# EAGLE design untitled (EAGLE 8.3.1)
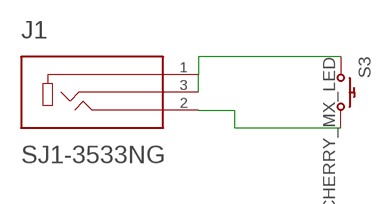
[diagram p0: schematic, sheet 1]

## Parts
J1  SJ1-3533NG  [CUI_SJ1-3533NG]
S3  CHERRY_MX_LED  [CHERRY_MX_LED]

## Nets
N$1: J1.1 J1.3 S3.S1
N$2: J1.2 S3.S2
Unconnected: S3.L1(A) S3.L2(C)

## Library data of the parts
J1 = SJ1-3533NG:SJ1-3533NG: 3.5 mm Right-Angle Stereo Jack, 3 Pin PCB Mount, Isolated Ground; MANUFACTURER: CUI; PARTREV: 1.02; STANDARD: Manufacturer recommendation
S3 = cherry:CHERRY_MX_LED: Cherry MX with LED; FARNELL: 2292961; MOUSER: 540_MX1A_11NW

## Board
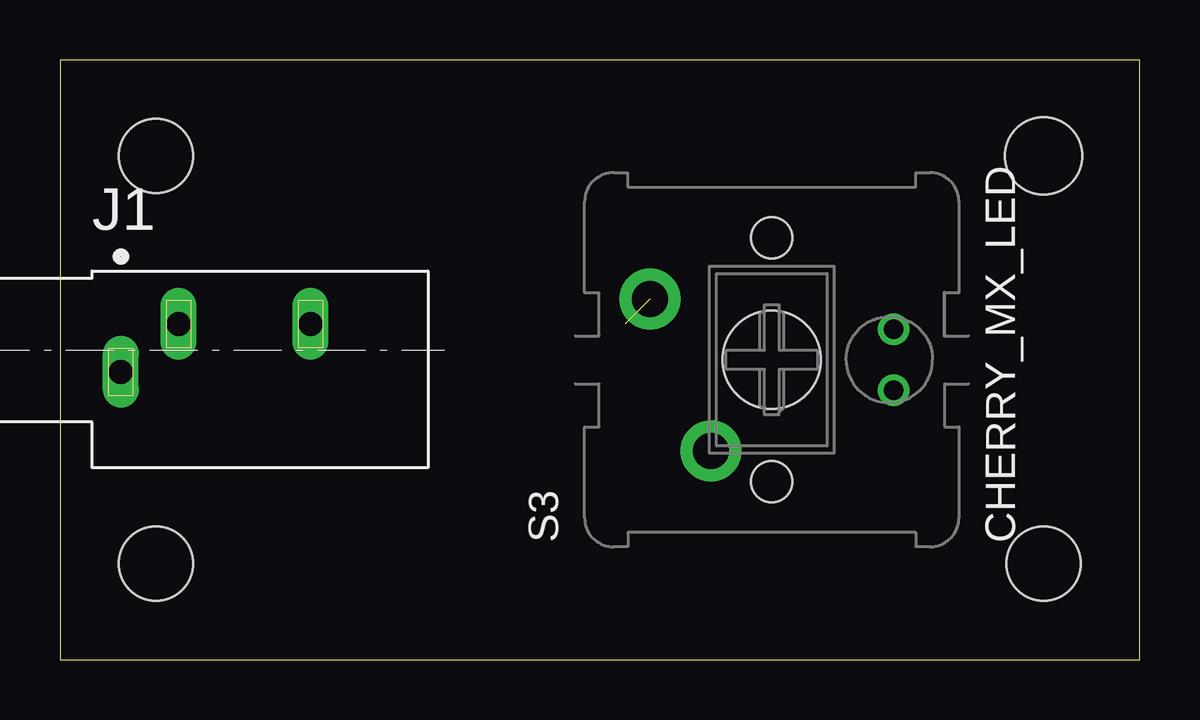
[diagram p1: board, top side]
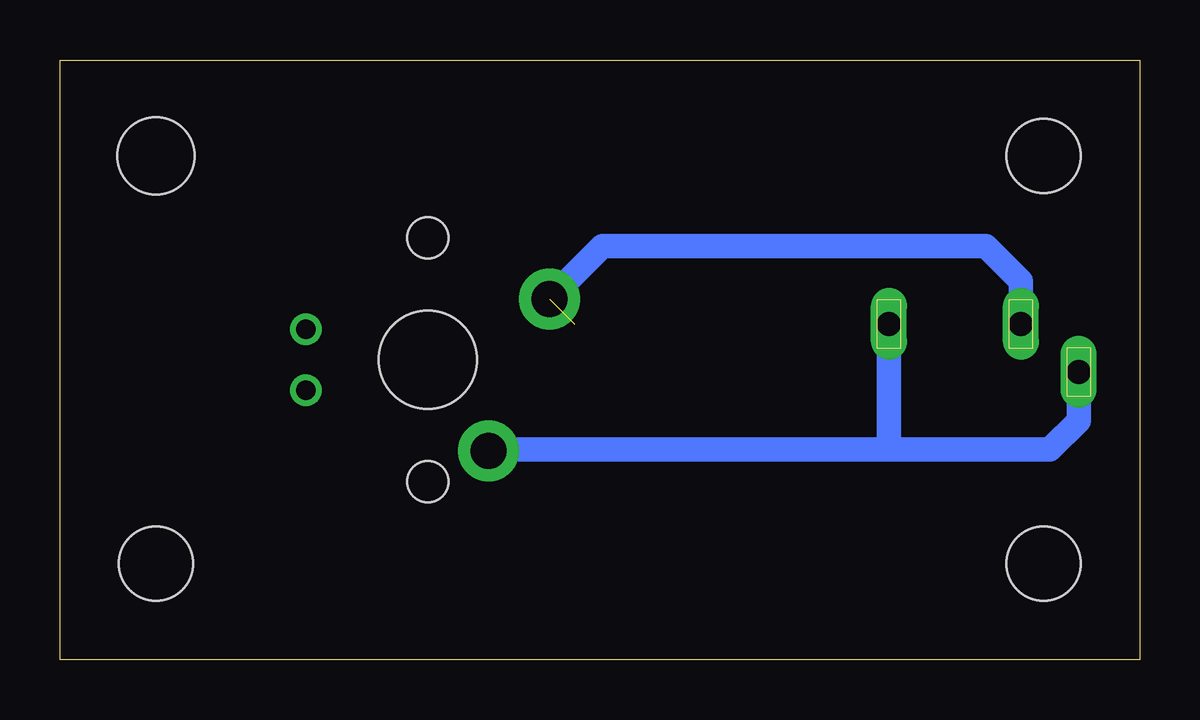
[diagram p2: board, bottom side, seen from below]

Size 45 x 25 mm. Coordinates in mm from the lower left corner, seen from the top.
Outline: 0,0 45,0 45,25 0,25 0,0
Copper layers (1*16): Top 0.035mm / dielectric 1.5mm / Bottom 0.035mm
Design rules "default": minimum track width 6mil, minimum drill 0.35mm, track to track 6mil, track to pad 6mil, pad to pad 6mil, via to via 6mil, smd to smd 6mil, copper to edge 40mil, drill to drill 6mil, minimum pad ring 10mil, minimum via ring 8mil, stop-mask expansion 4mil, vias tented up to drill 0mil, thermal gap 10mil
Holes 3.1 mm at 4,21 4,4 41,4
Holes 3.2 mm at 41,21

### Footprints (pad centres in the part's own frame; a part is rotated, then mirrored left to right if it is on the bottom)
CUI_SJ1-3533NG = drill 1 long: 1 0,0; 2 2.4,2; 3 7.9,2
CHERRY_MX_LED = drill 0.8: L1 -1.27,-5.08; L2 1.27,-5.08 | drill 1.5 pad 2.54: S1 -3.81,2.54; S2 2.54,5.08 | hole 1.7: -5.08,0; 5.08,0 | hole 4.1: 0,0

### Placement (x,y rotation side)
J1  2.54,12 0 top
S3  29.67,12.5 90 top

### Tracks (layer width: path | path; a pad name or v marks a point on that pad's centre or on a via)
N$1
  Bottom 1.016: J1.1 2.54,9.96 3.73,8.76 10.59,8.76 | 10.59,8.76 27.06,8.76 S3.S1 | J1.3 10.44,8.91 10.59,8.76
N$2  (1 unrouted)
  Bottom 1.016: J1.2 4.94,15.79 6.4,17.25 22.38,17.25 S3.S2